# EAGLE design LoRaBee (EAGLE 9.6.2)
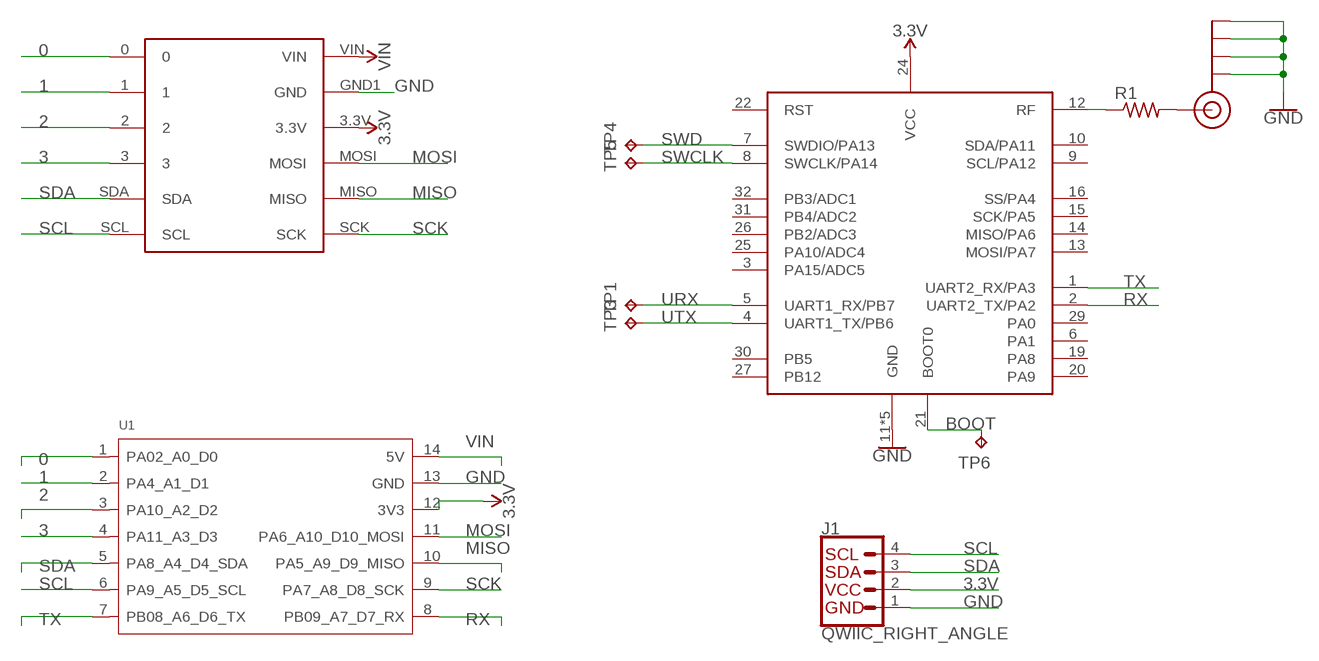
[diagram p0: schematic, sheet 1]

## Parts
J1  QWIIC_RIGHT_ANGLE  QWIIC_CONNECTORJS-1MM  [JST04_1MM_RA]
J$1  SMA_EDGE  [SMA-EDGE]
R1  R-US_R0805  [R0805]
TP1  TPTP12R  [TP12R]
TP3  TPTP12R  [TP12R]
TP4  TPTP12R  [TP12R]
TP5  TPTP12R  [TP12R]
TP6  TPTP12R  [TP12R]
U1  MOUDLE-SEEEDUINO-XIAO  [MOUDLE14P-2.54-21X17.8MM]
U$1  BEEELINK  [BEEELINK]
U$2  RAK3172HF  [RAK3172]

## Nets
0: U1.1(PA02_A0_D0) U$1.0
1: U1.2(PA4_A1_D1) U$1.1
2: U1.3(PA10_A2_D2) U$1.2
3: U1.4(PA11_A3_D3) U$1.3
3.3V: J1.2 U1.12(3V3) U$1.3.3V U$2.24(VCC)
BOOT: TP6.TP U$2.21(BOOT0)
GND: J1.1 J$1.GND@0(GND) J$1.GND@1(GND) J$1.GND@2(GND) J$1.GND@3(GND) U1.13(GND) U$1.GND1(GND) U$2.11(GND) U$2.17(GND) U$2.18(GND) U$2.23(GND) U$2.28(GND)
MISO: U1.10(PA5_A9_D9_MISO) U$1.MISO
MOSI: U1.11(PA6_A10_D10_MOSI) U$1.MOSI
N$1: R1.1 U$2.12(RF)
N$2: J$1.SIG(SIGNAL) R1.2
RX: U1.8(PB09_A7_D7_RX) U$2.2(UART2_TX/PA2)
SCK: U1.9(PA7_A8_D8_SCK) U$1.SCK
SCL: J1.4 U1.6(PA9_A5_D5_SCL) U$1.SCL
SDA: J1.3 U1.5(PA8_A4_D4_SDA) U$1.SDA
SWCLK: TP5.TP U$2.8(SWCLK/PA14)
SWD: TP4.TP U$2.7(SWDIO/PA13)
TX: U1.7(PB08_A6_D6_TX) U$2.1(UART2_RX/PA3)
URX: TP1.TP U$2.5(UART1_RX/PB7)
UTX: TP3.TP U$2.4(UART1_TX/PB6)
VIN: U1.14(5V) U$1.VIN
Unconnected: U$2.3(PA15/ADC5) U$2.6(PA1) U$2.9(SCL/PA12) U$2.10(SDA/PA11) U$2.13(MOSI/PA7) U$2.14(MISO/PA6) U$2.15(SCK/PA5) U$2.16(SS/PA4) U$2.19(PA8) U$2.20(PA9) U$2.22(RST) U$2.25(PA10/ADC4) U$2.26(PB2/ADC3) U$2.27(PB12) U$2.29(PA0) U$2.30(PB5) U$2.31(PB4/ADC2) U$2.32(PB3/ADC1)

## Library data of the parts
J1 = SparkFun-Connectors:QWIIC_CONNECTOR: SparkFun I2C Standard Qwiic Connector An SMD 1mm pitch JST connector makes it easy and quick (get it? Qwiic?) to connect I2C devices to each other. The Qwiic system <http://www.sparkfun.com/qwiic> enables fast and solderless connection between popular platforms and various sensors and actuators. We carry 200mm <https://www.sparkfun.com/products/14204>, 100mm <https://www.sparkfun.com/products/14205>, 50mm <https://www.sparkfun.com/products/14206>, and breadboard friendly <https://www.sparkfun.com/products/14207> Qwiic cables. We also offer 10 pcs strips <https://www.sparkfun.com/products/14323> the SMD connectors.; PROD_ID: CONN-13694
J$1 = SparkFun-Retired:SMA_EDGE: SMA Antenna Connector End launch SMA connector. The paste layer has been removed so that the connector can be hand soldered onto the board after reflow.
R1 = resistor:R-US_: RESISTOR, American symbol
TP1 TP3-TP6 = testpad:TP: Test pad
U1 = Seeeduino XIAO:MOUDLE-SEEEDUINO-XIAO
U$1 = BeeeLink:BEEELINK
U$2 = RAK3172-Breakout:RAK3172: RAK4260 LoRaWAN module from RAKwireless.

## Board
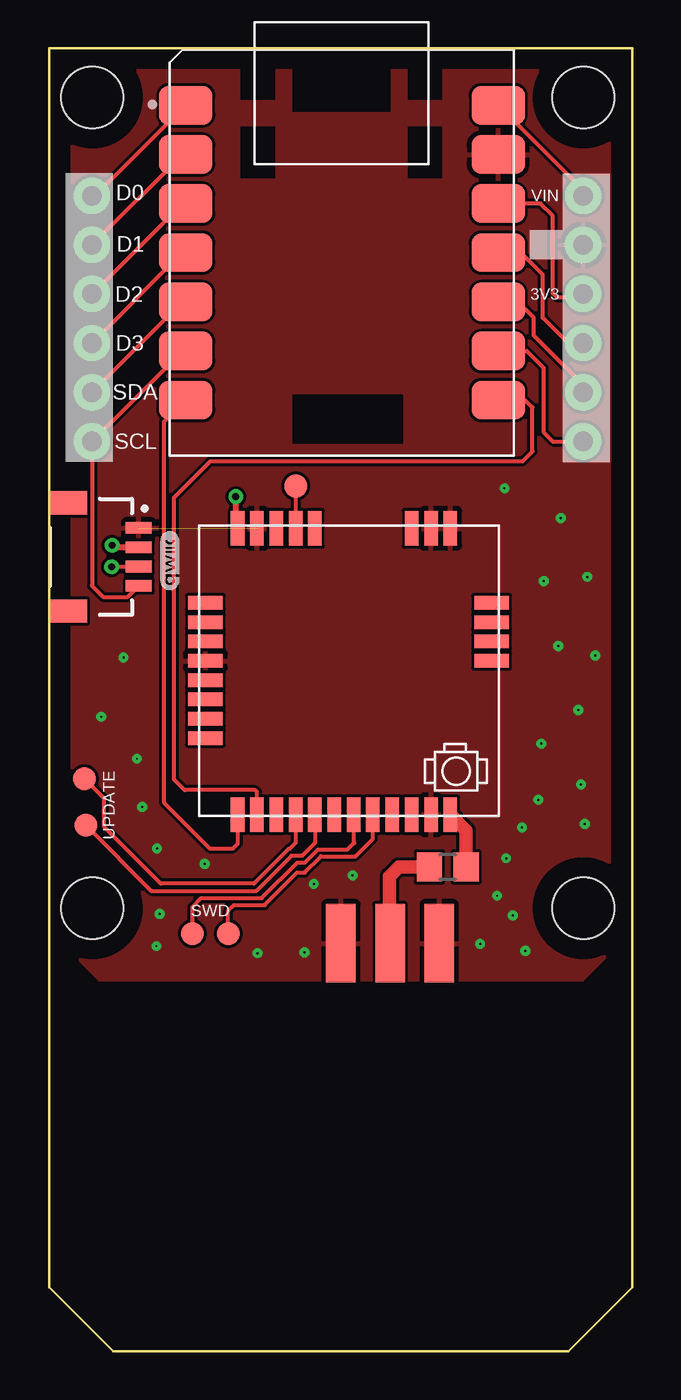
[diagram p1: board, top side]
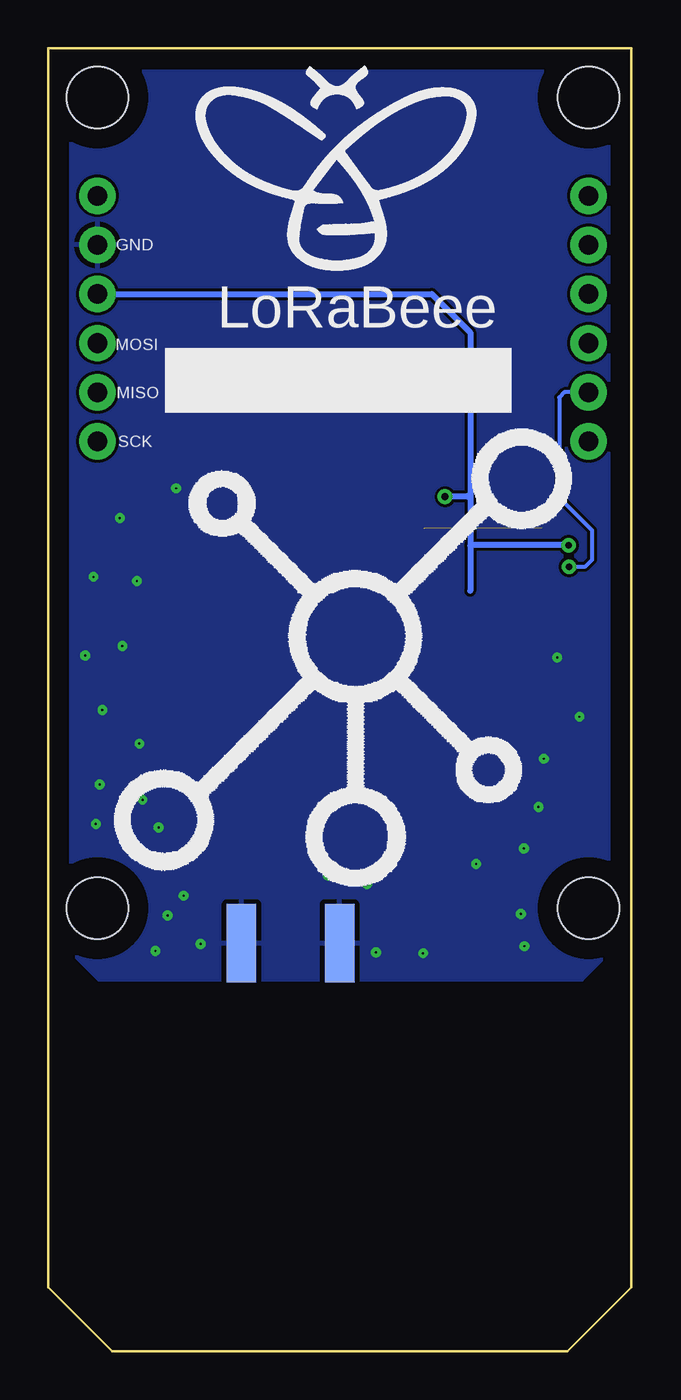
[diagram p2: board, bottom side, seen from below]

Size 30.15 x 67.35 mm. Coordinates in mm from the lower left corner, seen from the top.
Copper layers (1*16): Top 0.035mm / dielectric 1.5mm / Bottom 0.035mm
Design rules "default": minimum track width 6mil, minimum drill 0.35mm, track to track 6mil, track to pad 6mil, pad to pad 6mil, via to via 6mil, smd to smd 6mil, copper to edge 40mil, drill to drill 6mil, minimum pad ring 10mil, minimum via ring 8mil, stop-mask expansion 4mil, vias tented up to drill 0mil, thermal gap 10mil

### Footprints (pad centres in the part's own frame; a part is rotated, then mirrored left to right if it is on the bottom)
JST04_1MM_RA = smd 0.6 x 1.35: 1 -1.5,0; 2 -0.5,0; 3 0.5,0; 4 1.5,0 | smd 1.2 x 2: NC1 2.8,-3.675; NC2 -2.8,-3.675
SMA-EDGE = smd 1.524 x 4.064: GND@0 0,0; GND@1 5.08,0; SIG 2.54,0 | smd 1.524 x 4.064 bottom: GND@2 0,0; GND@3 5.08,0
R0805 = smd 1.3 x 1.5: 1 -0.95,0; 2 0.95,0
TP12R = smd 1.2 x 1.2: TP 0,0
MOUDLE14P-2.54-21X17.8MM = smd 2.75 x 2: 1 0.835,18.12; 2 0.835,15.58; 3 0.835,13.04; 4 0.835,10.5; 5 0.835,7.96; 6 0.835,5.42; 7 0.835,2.88; 8 17,2.88; 9 17,5.42; 10 17,7.96; 11 17,10.5; 12 17,13.04; 13 17,15.58; 14 17,18.12
BEEELINK = drill 1.016 pad 1.88: 0 29.21,39.37; 1 29.21,36.83; 2 29.21,34.29; 3 29.21,31.75; 3.3V 54.61,34.29; GND1 54.61,36.83; MISO 54.61,29.21; MOSI 54.61,31.75; SCK 54.61,26.67; SCL 29.21,26.67; SDA 29.21,29.21; VIN 54.61,39.37 | hole 3.2: 29.21,44.45; 54.61,44.45; 29.21,2.54; 54.61,2.54
RAK3172 = smd 0.7 x 1.8: 1 13.5,14.945; 2 12.5,14.945; 3 11.5,14.945; 4 10.5,14.945; 5 9.5,14.945; 6 8.5,14.945; 7 7.5,14.945; 8 6.5,14.945; 9 5.5,14.945; 10 4.5,14.945; 11 3.5,14.945; 12 2.5,14.945; 17 2.5,0.145; 18 3.5,0.145; 19 4.5,0.145; 20 9.5,0.145; 21 10.5,0.145; 22 11.5,0.145; 23 12.5,0.145; 24 13.5,0.145 | smd 1.8 x 0.7: 13 0.365,6.99; 14 0.365,5.99; 15 0.365,4.99; 16 0.365,3.99; 25 15.165,3.99; 26 15.165,4.99; 27 15.165,5.99; 28 15.165,6.99; 29 15.165,7.99; 30 15.165,8.99; 31 15.165,9.99; 32 15.165,10.99

### Placement (x,y rotation side)
J1  4.63,41.06 270 top
J$1  15.08,21.08 0 top
R1  20.61,25.03 180 top
TP1  1.9,27.18 0 top
TP3  1.83,29.58 0 top
TP4  7.4,21.58 0 top
TP5  9.25,21.59 0 top
TP6  12.74,44.72 0 top
U1  6.22,46.28 0 top
U$1  -27,20.36 0 top
U$2  23.24,42.68 180 top
U$3  [LOGO]  26.73,24.04 0 bottom
U$4  [BEEE_LOGO_M]  22.92,53.47 0 bottom
U$5  [QWIIC_3MM]  6.23,40.86 90 top

### Tracks (layer width: path | path; a pad name or v marks a point on that pad's centre or on a via)
0
  Top 0.2: U1.1 2.38,59.73 U$1.0
1
  Top 0.2: U$1.1 6.89,61.86 U1.2
2
  Top 0.2: U$1.2 6.56,59 6.56,59.51 6.87,59.51 U1.3
3
  Top 0.2: U$1.3 6.54,56.44 6.54,57.1 6.73,57.1 U1.4
3.3V  (via drill 0.35)
  Top 0.2: U$1.3.3V 27.43,54.46 26.26,54.46 26.04,54.69 26.04,58.69 25.41,59.32 U1.12
  Top 0.305: v9.64,44.17 9.64,42.63 U$2.24 | v3.25,41.66 3.35,41.56 J1.2
  Bottom 0.305: U$1.3.3V 10.32,54.65 8.33,52.66 8.33,44.31 | 8.33,44.31 8.33,41.64 | 8.33,41.64 8.33,39.32 | 8.33,44.31 8.47,44.17 v9.64,44.17 | v3.25,41.66 8.31,41.66 8.33,41.64
BOOT
  Top 0.2: TP6.TP U$2.21
GND  (via drill 0.1)  (1 unrouted)
  other vias: 8.03,25.18 5.57,25.99 24.45,27.07 23.16,23.54 10.77,20.57 5.54,20.93 22.28,21.06 25.44,31.4 4.8,28.13 15.69,24.59 23.63,25.48 26.32,36.45 27.5,29.29 27.69,27.25 27.36,33.14 5.71,22.6 13.2,20.6 13.68,24.15 24.61,20.7 23.98,22.52 4.53,30.62 2.68,32.79 3.84,35.86 23.54,44.6 25.57,39.81 26.45,43.06 27.82,40.03 28.24,35.95 25.28,28.5
  pour Top: 0.18,67.17 29.93,67.17 30,67.1 30,21.64 27.55,19.19 2.62,19.19 0.16,21.64 0.16,67.16 0.17,67.17
  pour Bottom: 0.25,67.07 29.99,67.07 29.99,67.07 29.99,21.66 27.54,19.2 2.55,19.2 0.1,21.66 0.1,66.95 0.23,67.07
MISO
  Top 0.2: U$1.MISO 27.61,49.93 25.05,52.5 25.05,53.43 24.13,54.34 23.32,54.34 U1.10
MOSI
  Top 0.2: U$1.MOSI 27.57,52.06 26.88,52.06 25.52,53.43 25.52,55.65 24.24,56.93 23.37,56.93 U1.11
N$1
  Top 0.7: U$2.12 21.56,26.91 R1.1
N$2
  Top 0.7: R1.2 18.09,25.03 17.59,24.53 17.59,21.11 J$1.SIG
RX
  Top 0.2: U$2.2 10.74,28.91 10.65,29 7.01,29 6.45,29.56 6.45,44.12 8.33,46.01 24.49,46.01 24.99,46.51 24.99,48.78 24.6,49.16 U1.8
SCK
  Top 0.2: U1.9 24.69,51.7 25.56,50.83 25.56,47.51 26.05,47.03 U$1.SCK
SCL
  Top 0.2: U1.6 6.89,51.7 U$1.SCL 2.21,39.59 2.2,39.57 2.78,38.99 4.06,38.99 J1.4
  Top 0.305: U$1.SCL 2.45,46.79
SDA  (via drill 0.35)
  Top 0.2: U$1.SDA 6.89,54.24 U1.5 | v3.22,40.55 v3.23,40.56 J1.3
  Bottom 0.2: U$1.SDA 3.45,49.57 3.73,49.29 3.73,44.13 2.04,42.44 2.04,40.9 2.41,40.53 3.21,40.53 v3.22,40.55
SWCLK
  Top 0.2: TP5.TP 9.25,22.77 9.54,23.06 11.13,23.06 12.81,24.74 13.2,24.74 14.04,25.58 15.83,25.58 16.74,26.49 U$2.8
SWD
  Top 0.2: TP4.TP 7.4,22.96 7.86,23.42 10.99,23.42 12.83,25.26 13.22,25.26 13.89,25.93 15.42,25.93 15.76,26.27 15.76,27.71 U$2.7
TX
  Top 0.2: U1.7 5.91,48.02 5.91,28.37 8.29,25.99 9.51,25.99 9.76,26.25 9.76,27.71 U$2.1
URX
  Top 0.2: TP1.TP 5.28,23.8 10.71,23.8 12.52,25.61 13.07,25.61 13.74,26.28 U$2.5
UTX
  Top 0.2: U$2.4 12.74,26.27 12.43,25.96 12.38,25.96 10.58,24.17 5.77,24.17 2.85,27.09 2.85,28.56 TP3.TP
VIN
  Top 0.2: U1.14 27.61,60.01 U$1.VIN

### Text on the board
tNames: D0 | VIN | D1 | 3V3 | D2 | D3 | SDA | SCL | UPDATE | SWD
bNames: GND | LoRaBeee | MOSI | MISO | SCK